# EAGLE schematic Xtriker_Laser_v2 (EAGLE 9.6.1)
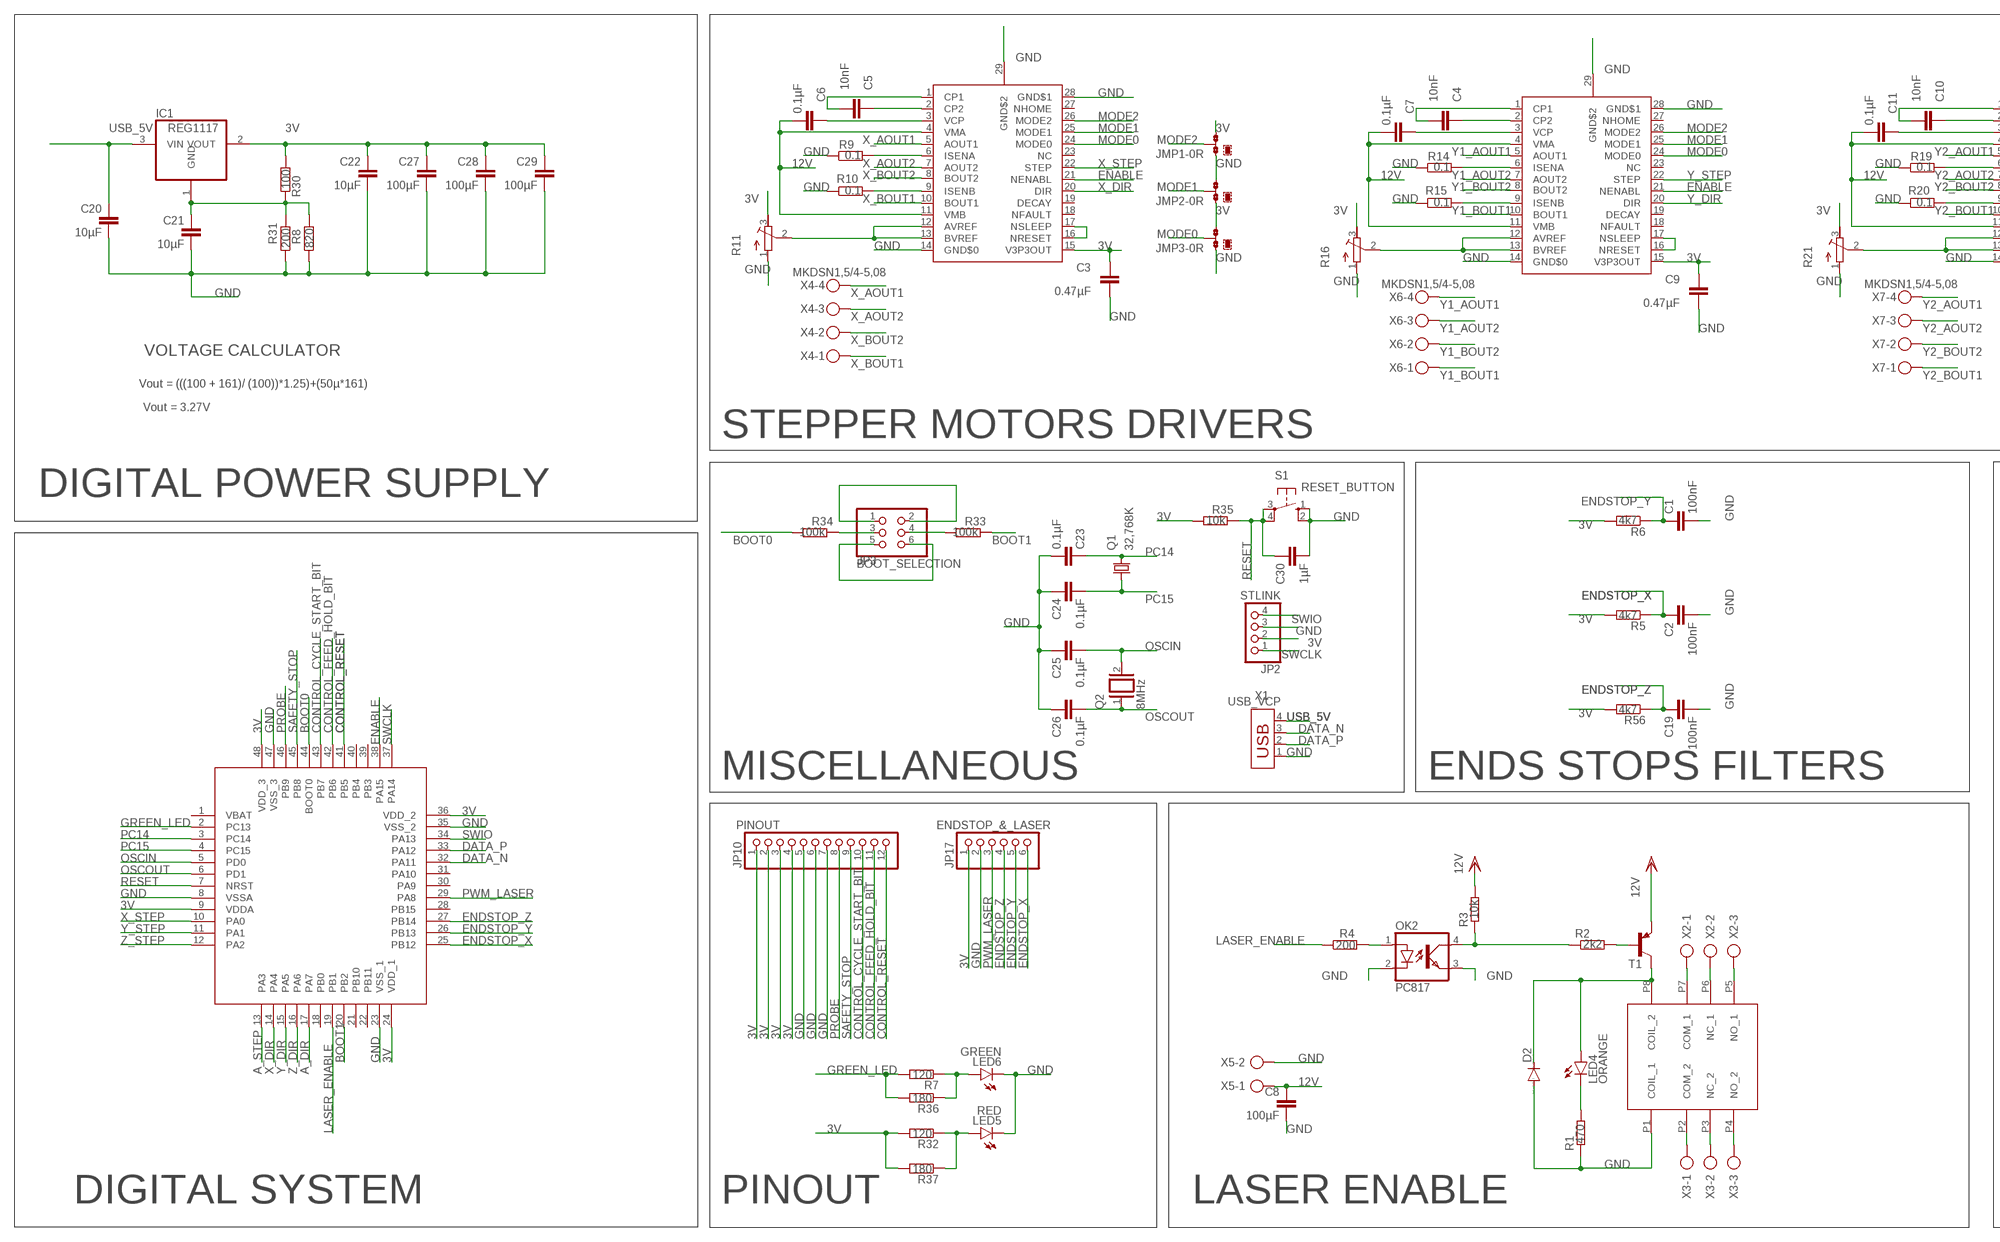
[diagram p0: schematic, sheet 1, part 1 of 2]
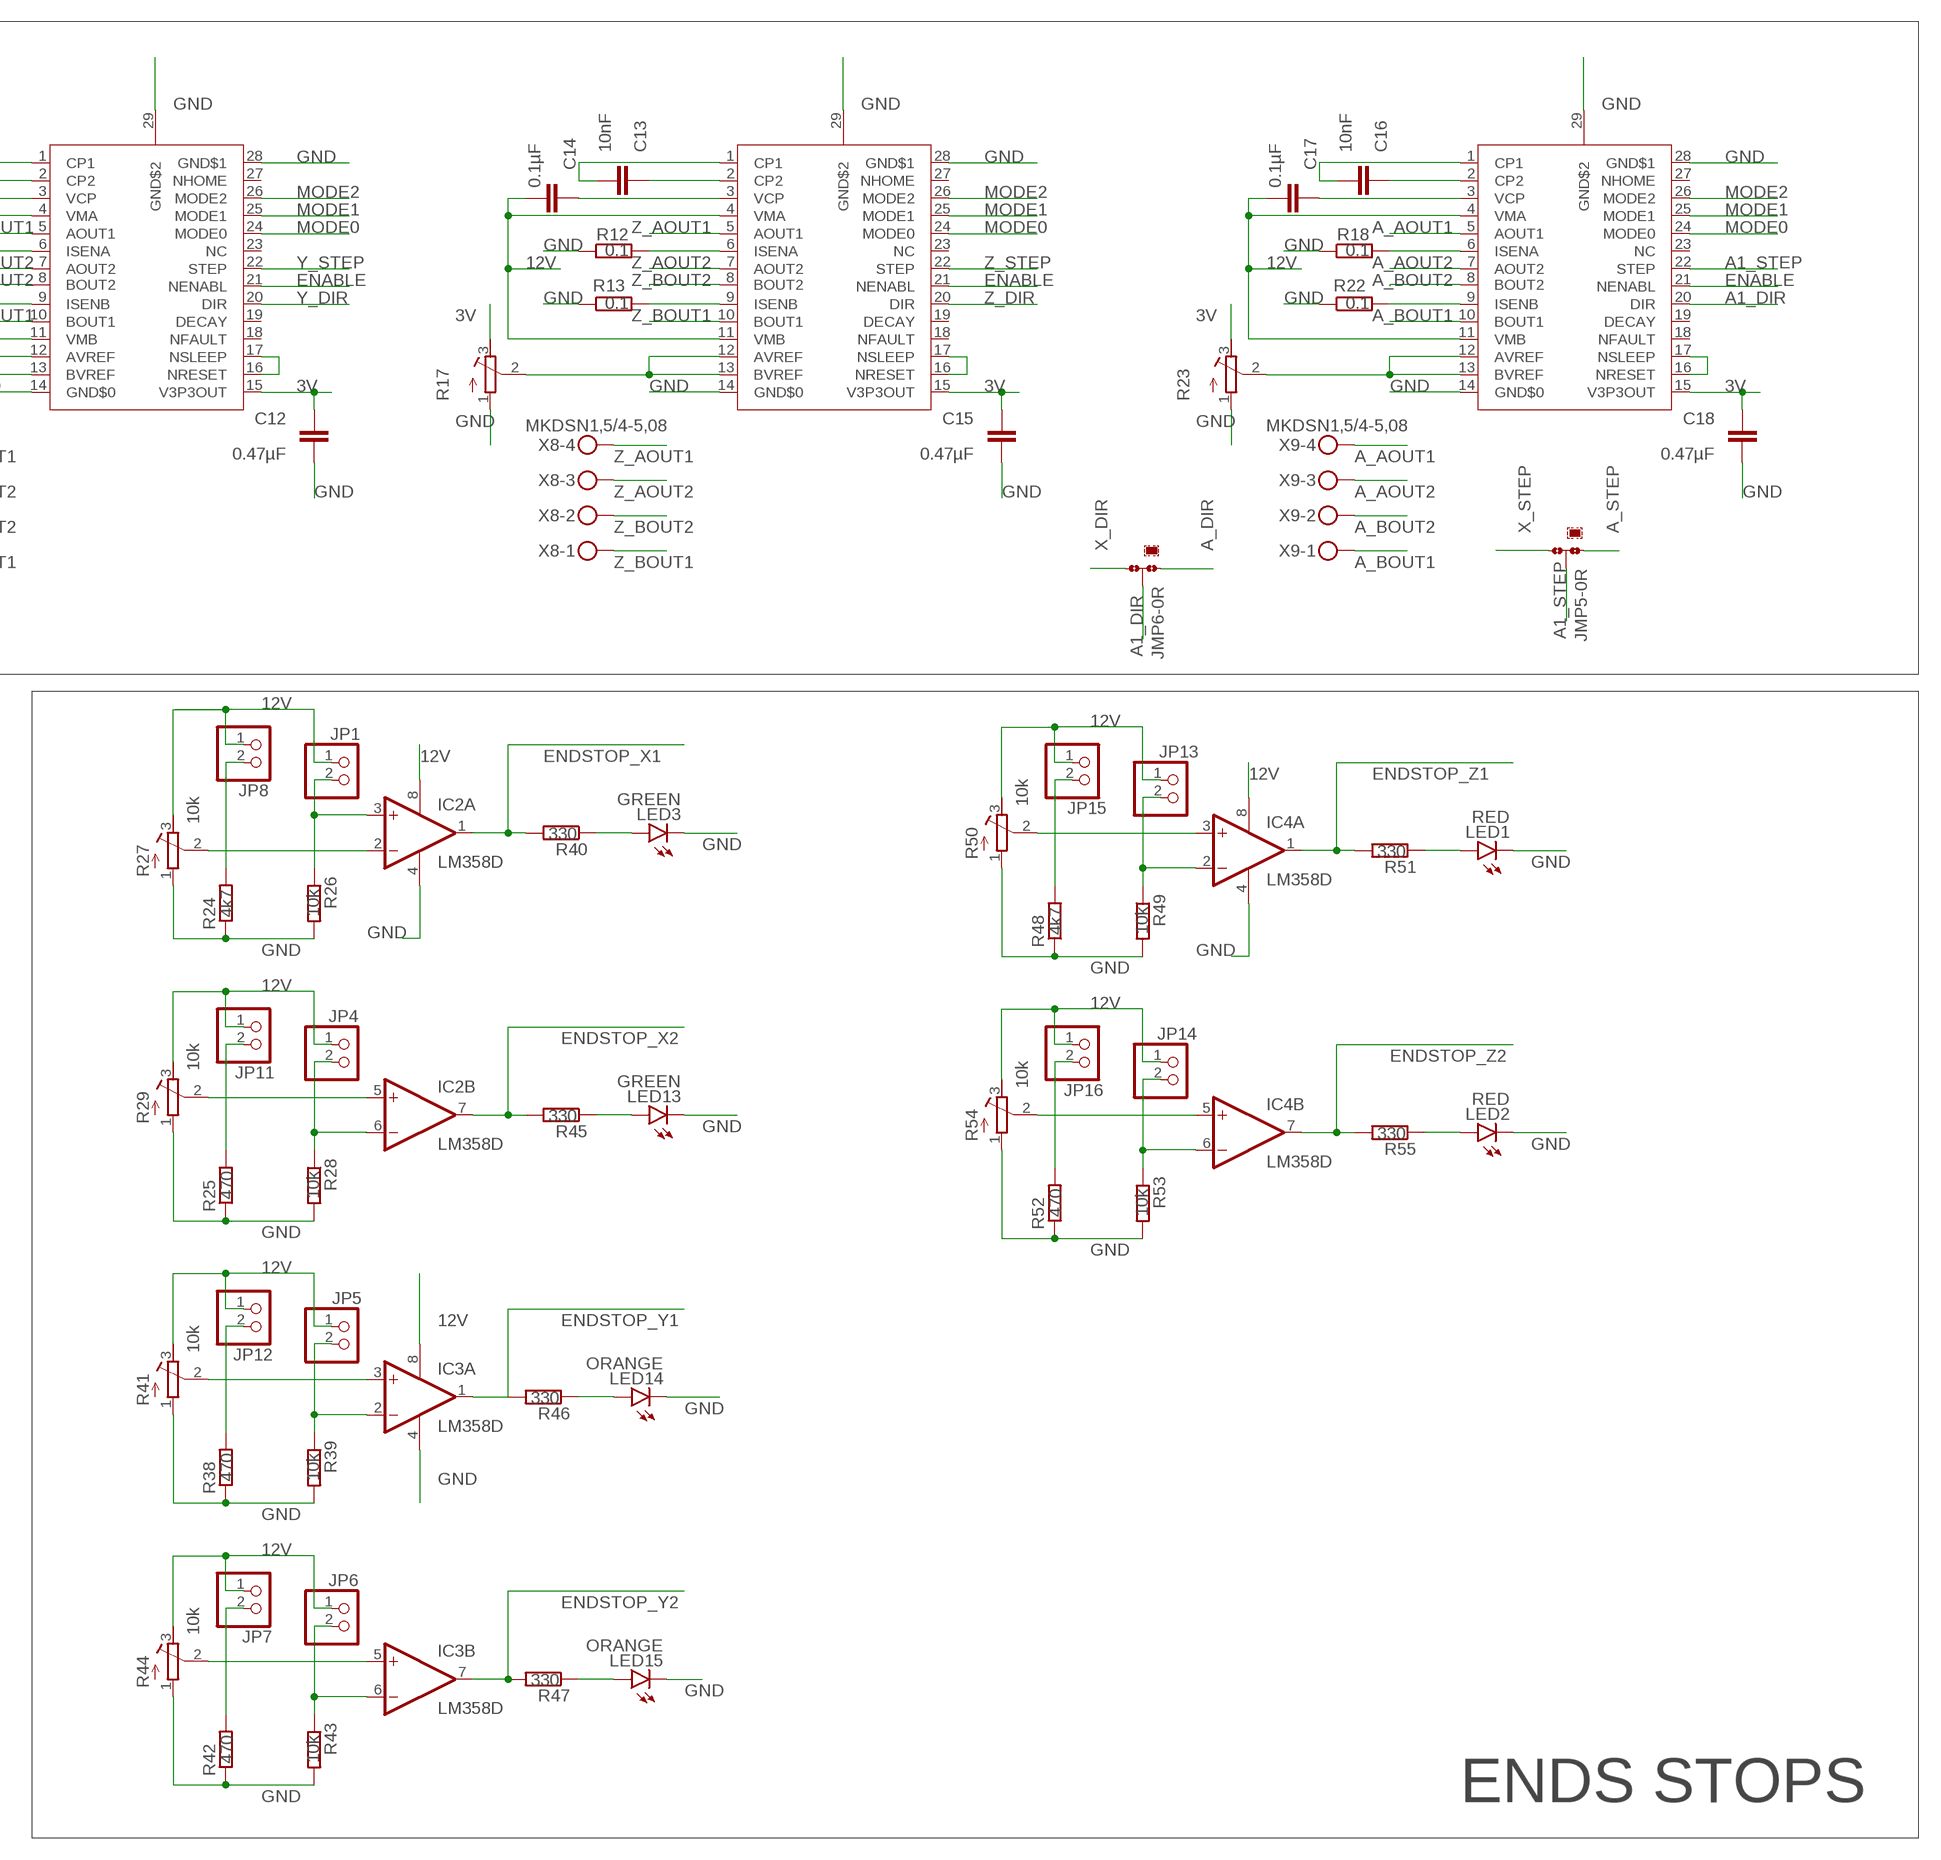
[diagram p1: schematic, sheet 1, part 2 of 2]

## Parts
C1  100nF  C-EUC0805  [C0805]
C2  100nF  C-EUC0805  [C0805]
C3  0.47µF  C-EUC0805  [C0805]
C4  10nF  C-EUC0805  [C0805]
C5  10nF  C-EUC0805  [C0805]
C6  0.1µF  C-EUC0805  [C0805]
C7  0.1µF  C-EUC0805  [C0805]
C8  100µF  C-EUC0805  [C0805]
C9  0.47µF  C-EUC0805  [C0805]
C10  10nF  C-EUC0805  [C0805]
C11  0.1µF  C-EUC0805  [C0805]
C12  0.47µF  C-EUC0805  [C0805]
C13  10nF  C-EUC0805  [C0805]
C14  0.1µF  C-EUC0805  [C0805]
C15  0.47µF  C-EUC0805  [C0805]
C16  10nF  C-EUC0805  [C0805]
C17  0.1µF  C-EUC0805  [C0805]
C18  0.47µF  C-EUC0805  [C0805]
C19  100nF  C-EUC0805  [C0805]
C20  10µF  C-EUC0805  [C0805]
C21  10µF  C-EUC0805  [C0805]
C22  10µF  C-EUC0805  [C0805]
C23  0.1µF  C-EUC0805  [C0805]
C24  0.1µF  C-EUC0805  [C0805]
C25  0.1µF  C-EUC0805  [C0805]
C26  0.1µF  C-EUC0805  [C0805]
C27  100µF  C-EUC0805  [C0805]
C28  100µF  C-EUC0805  [C0805]
C29  100µF  C-EUC0805  [C0805]
C30  1µF  C-EUC0805  [C0805]
D2  DIODE-DO214AA  [DO214AA]
IC1  REG1117  [SOT223]
IC2  LM358D  [SO08]
IC3  LM358D  [SO08]
IC4  LM358D  [SO08]
JMP1  0R-JUMPA  [A0R-JMP]
JMP2  0R-JUMPA  [A0R-JMP]
JMP3  0R-JUMPA  [A0R-JMP]
JMP5  0R-JUMPA  [A0R-JMP]
JMP6  0R-JUMPA  [A0R-JMP]
JP1  PINHD-1X2  [1X02]
JP2  STLINK  PINHD-1X4  [1X04]
JP3  BOOT_SELECTION  PINHD-2X3  [2X03]
JP4  PINHD-1X2  [1X02]
JP5  PINHD-1X2  [1X02]
JP6  PINHD-1X2  [1X02]
JP7  PINHD-1X2  [1X02]
JP8  PINHD-1X2  [1X02]
JP10  PINOUT  PINHD-1X12  [1X12]
JP11  PINHD-1X2  [1X02]
JP12  PINHD-1X2  [1X02]
JP13  PINHD-1X2  [1X02]
JP14  PINHD-1X2  [1X02]
JP15  PINHD-1X2  [1X02]
JP16  PINHD-1X2  [1X02]
JP17  ENDSTOP_&_LASER  PINHD-1X6  [1X06]
LED1  RED  LEDCHIP-LED0805  [CHIP-LED0805]
LED2  RED  LEDCHIP-LED0805  [CHIP-LED0805]
LED3  GREEN  LEDCHIP-LED0805  [CHIP-LED0805]
LED4  ORANGE  LEDCHIP-LED0805  [CHIP-LED0805]
LED5  RED  LEDCHIP-LED0805  [CHIP-LED0805]
LED6  GREEN  LEDCHIP-LED0805  [CHIP-LED0805]
LED13  GREEN  LEDCHIP-LED0805  [CHIP-LED0805]
LED14  ORANGE  LEDCHIP-LED0805  [CHIP-LED0805]
LED15  ORANGE  LEDCHIP-LED0805  [CHIP-LED0805]
OK2  PC817  [DIL04]
Q1  32,768K  KX-327-S  [8.2X3.8]
Q2  8MHz  XTAL/S  [QS]
R1  470  R-EU_R0805  [R0805]
R2  2k2  R-EU_R0805  [R0805]
R3  10k  R-EU_R0805  [R0805]
R4  200  R-EU_R0805  [R0805]
R5  4k7  R-EU_R0805  [R0805]
R6  4k7  R-EU_R0805  [R0805]
R7  120  R-EU_R0805  [R0805]
R8  820  R-EU_R0805  [R0805]
R9  0.1  R-EU_R2512  [R2512]
R10  0.1  R-EU_R2512  [R2512]
R11  R-TRIMM3296W  [RTRIM3296W]
R12  0.1  R-EU_R2512  [R2512]
R13  0.1  R-EU_R2512  [R2512]
R14  0.1  R-EU_R2512  [R2512]
R15  0.1  R-EU_R2512  [R2512]
R16  R-TRIMM3296W  [RTRIM3296W]
R17  R-TRIMM3296W  [RTRIM3296W]
R18  0.1  R-EU_R2512  [R2512]
R19  0.1  R-EU_R2512  [R2512]
R20  0.1  R-EU_R2512  [R2512]
R21  R-TRIMM3296W  [RTRIM3296W]
R22  0.1  R-EU_R2512  [R2512]
R23  R-TRIMM3296W  [RTRIM3296W]
R24  4k7  R-EU_R0805  [R0805]
R25  470  R-EU_R0805  [R0805]
R26  10k  R-EU_R0805  [R0805]
R27  10k  R-TRIMM3296W  [RTRIM3296W]
R28  10k  R-EU_R0805  [R0805]
R29  10k  R-TRIMM3296W  [RTRIM3296W]
R30  100  R-EU_R0805  [R0805]
R31  200  R-EU_R0805  [R0805]
R32  120  R-EU_R0805  [R0805]
R33  100k  R-EU_R0805  [R0805]
R34  100k  R-EU_R0805  [R0805]
R35  10k  R-EU_R0805  [R0805]
R36  180  R-EU_R0805  [R0805]
R37  180  R-EU_R0805  [R0805]
R38  470  R-EU_R0805  [R0805]
R39  10k  R-EU_R0805  [R0805]
R40  330  R-EU_R0805  [R0805]
R41  10k  R-TRIMM3296W  [RTRIM3296W]
R42  470  R-EU_R0805  [R0805]
R43  10k  R-EU_R0805  [R0805]
R44  10k  R-TRIMM3296W  [RTRIM3296W]
R45  330  R-EU_R0805  [R0805]
R46  330  R-EU_R0805  [R0805]
R47  330  R-EU_R0805  [R0805]
R48  4k7  R-EU_R0805  [R0805]
R49  10k  R-EU_R0805  [R0805]
R50  10k  R-TRIMM3296W  [RTRIM3296W]
R51  330  R-EU_R0805  [R0805]
R52  470  R-EU_R0805  [R0805]
R53  10k  R-EU_R0805  [R0805]
R54  10k  R-TRIMM3296W  [RTRIM3296W]
R55  330  R-EU_R0805  [R0805]
R56  4k7  R-EU_R0805  [R0805]
S1  RESET_BUTTON  10-XX  [B3F-10XX]
T1  -PNP-SOT23-BCE  [SOT23-BCE]
U$1  DRV8825  [SOP65P660X135-29T310X518N]
U$2  DRV8825  [SOP65P660X135-29T310X518N]
U$3  DRV8825  [SOP65P660X135-29T310X518N]
U$4  DRV8825  [SOP65P660X135-29T310X518N]
U$5  TDS-1202L  [TDS_1202L]
U$6  STM32F103C8_LQFP48  [QFP50P900X900X160-48N]
U$7  DRV8825  [SOP65P660X135-29T310X518N]
X1  USB_VCP  USB-787616  [USB]
X2  AK500/3  [AK500/3]
X3  AK500/3  [AK500/3]
X4  MKDSN1,5/4-5,08  [MKDSN1,5/4-5,08]
X5  AK500/2  [AK500/2]
X6  MKDSN1,5/4-5,08  [MKDSN1,5/4-5,08]
X7  MKDSN1,5/4-5,08  [MKDSN1,5/4-5,08]
X8  MKDSN1,5/4-5,08  [MKDSN1,5/4-5,08]
X9  MKDSN1,5/4-5,08  [MKDSN1,5/4-5,08]

## Nets
3V: C3.1 C9.1 C12.1 C15.1 C18.1 C22.1 C27.1 C28.1 C29.1 IC1.2(VOUT) JMP1.3 JMP2.1 JMP3.3 JP2.2 JP10.1 JP10.2 JP10.3 JP10.4 JP17.1 R5.2 R6.2 R11.3(E) R16.3(E) R17.3(E) R21.3(E) R23.3(E) R30.2 R32.2 R35.2 R37.2 R56.2 U$1.15(V3P3OUT) U$2.15(V3P3OUT) U$3.15(V3P3OUT) U$4.15(V3P3OUT) U$6.9(VDDA) U$6.24(VDD_1) U$6.36(VDD_2) U$6.48(VDD_3) U$7.15(V3P3OUT)
12V: C6.2 C7.2 C8.1 C11.2 C14.2 C17.2 IC2.8(P:V+) IC3.8(P:V+) IC4.8(P:V+) JP1.1 JP4.1 JP5.1 JP6.1 JP7.1 JP8.1 JP11.1 JP12.1 JP13.1 JP14.1 JP15.1 JP16.1 R27.3(E) R29.3(E) R41.3(E) R44.3(E) R50.3(E) R54.3(E) U$1.4(VMA) U$1.11(VMB) U$2.4(VMA) U$2.11(VMB) U$3.4(VMA) U$3.11(VMB) U$4.4(VMA) U$4.11(VMB) U$7.4(VMA) U$7.11(VMB) X5.1
A1_DIR: JMP6.2 U$7.20(DIR)
A1_STEP: JMP5.2 U$7.22(STEP)
A_AOUT1: U$7.5(AOUT1) X9.4
A_AOUT2: U$7.7(AOUT2) X9.3
A_BOUT1: U$7.10(BOUT1) X9.1
A_BOUT2: U$7.8(BOUT2) X9.2
A_DIR: JMP6.1 U$6.17(PA7)
A_STEP: JMP5.1 U$6.13(PA3)
BOOT0: R34.2 U$6.44(BOOT0)
BOOT1: R33.1 U$6.20(PB2)
CONTROL_CYCLE_START_BIT: JP10.10 U$6.43(PB7)
CONTROL_FEED_HOLD_BIT: JP10.11 U$6.42(PB6)
CONTROL_RESET: JP10.12 U$6.41(PB5)
DATA_N [Diff]: U$6.32(PA11) X1.3
DATA_P [Diff]: U$6.33(PA12) X1.2
ENABLE: U$1.21(NENABL) U$2.21(NENABL) U$3.21(NENABL) U$4.21(NENABL) U$6.38(PA15) U$7.21(NENABL)
ENDSTOP_X: C2.1 JP17.6 R5.1 U$6.25(PB12)
ENDSTOP_X1: IC2.1(A:OUT) R40.2
ENDSTOP_X2: IC2.7(B:OUT) R45.2
ENDSTOP_Y: C1.1 JP17.5 R6.1 U$6.26(PB13)
ENDSTOP_Y1: IC3.1(A:OUT) R46.2
ENDSTOP_Y2: IC3.7(B:OUT) R47.2
ENDSTOP_Z: C19.1 JP17.4 R56.1 U$6.27(PB14)
ENDSTOP_Z1: IC4.1(A:OUT) R51.2
ENDSTOP_Z2: IC4.7(B:OUT) R55.2
GND: C1.2 C2.2 C3.2 C8.2 C9.2 C12.2 C15.2 C18.2 C19.2 C20.2 C21.2 C22.2 C23.2 C24.1 C25.1 C26.1 C27.2 C28.2 C29.2 C30.2 D2.A IC2.4(P:V-) IC3.4(P:V-) IC4.4(P:V-) JMP1.1 JMP2.3 JMP3.1 JP2.3 JP10.5 JP10.6 JP10.7 JP17.2 LED1.C LED2.C LED3.C LED5.C LED6.C LED13.C LED14.C LED15.C OK2.2(C) OK2.3(EMIT) R1.1 R8.1 R9.1 R10.1 R11.1(A) R12.1 R13.1 R14.1 R15.1 R16.1(A) R17.1(A) R18.1 R19.1 R20.1 R21.1(A) R22.1 R23.1(A) R24.1 R25.1 R26.2 R27.1(A) R28.2 R29.1(A) R31.1 R38.1 R39.2 R41.1(A) R42.1 R43.2 R44.1(A) R48.1 R49.2 R50.1(A) R52.1 R53.2 R54.1(A) S1.1(S) S1.2(S1) U$1.14(GND$0) U$1.28(GND$1) U$1.29(GND$2) U$2.14(GND$0) U$2.28(GND$1) U$2.29(GND$2) U$3.14(GND$0) U$3.28(GND$1) U$3.29(GND$2) U$4.14(GND$0) U$4.28(GND$1) U$4.29(GND$2) U$5.P1(COIL_1) U$6.8(VSSA) U$6.23(VSS_1) U$6.35(VSS_2) U$6.47(VSS_3) U$7.14(GND$0) U$7.28(GND$1) U$7.29(GND$2) X1.1 X5.2
GREEN_LED: R7.2 R36.2 U$6.2(PC13)
LASER_ENABLE: R4.1 U$6.19(PB1)
MODE0: JMP3.2 U$1.24(MODE0) U$2.24(MODE0) U$3.24(MODE0) U$4.24(MODE0) U$7.24(MODE0)
MODE1: JMP2.2 U$1.25(MODE1) U$2.25(MODE1) U$3.25(MODE1) U$4.25(MODE1) U$7.25(MODE1)
MODE2: JMP1.2 U$1.26(MODE2) U$2.26(MODE2) U$3.26(MODE2) U$4.26(MODE2) U$7.26(MODE2)
N$1: C13.2 U$4.1(CP1)
N$2: U$1.16(NRESET) U$1.17(NSLEEP)
N$3: C4.2 U$2.1(CP1)
N$4: C4.1 U$2.2(CP2)
N$5: C7.1 U$2.3(VCP)
N$6: R14.2 U$2.6(ISENA)
N$7: R15.2 U$2.9(ISENB)
N$8: R16.2(S) U$2.12(AVREF) U$2.13(BVREF)
N$9: C21.1 IC1.1(GND) R8.2 R30.1 R31.2
N$10: LED5.A R32.1 R37.1
N$11: JP3.1 JP3.2
N$12: C13.1 U$4.2(CP2)
N$13: D2.C LED4.A T1.C U$5.P8(COIL_2)
N$14: LED4.C R1.2
N$15: R2.2 T1.B
N$16: OK2.4(COL) R2.1 R3.1
N$17: OK2.1(A) R4.2
N$18: U$2.16(NRESET) U$2.17(NSLEEP)
N$19: C10.2 U$3.1(CP1)
N$20: C10.1 U$3.2(CP2)
N$21: C11.1 U$3.3(VCP)
N$22: C5.2 U$1.1(CP1)
N$23: C5.1 U$1.2(CP2)
N$24: C6.1 U$1.3(VCP)
N$25: R19.2 U$3.6(ISENA)
N$26: R20.2 U$3.9(ISENB)
N$27: R9.2 U$1.6(ISENA)
N$28: R21.2(S) U$3.12(AVREF) U$3.13(BVREF)
N$29: U$5.P7(COM_1) X2.1
N$30: U$5.P6(NC_1) X2.2
N$31: U$5.P5(NO_1) X2.3
N$32: U$5.P4(NO_2) X3.3
N$33: U$5.P3(NC_2) X3.2
N$34: U$5.P2(COM_2) X3.1
N$35: LED6.A R7.1 R36.1
N$36: C14.1 U$4.3(VCP)
N$37: R10.2 U$1.9(ISENB)
N$38: U$3.16(NRESET) U$3.17(NSLEEP)
N$39: LED3.A R40.1
N$40: IC2.3(A:+IN) JP1.2 R26.1
N$41: JP3.5 JP3.6
N$42: JP3.3 R34.1
N$43: JP3.4 R33.2
N$44: R11.2(S) U$1.12(AVREF) U$1.13(BVREF)
N$45: JP8.2 R24.2
N$46: IC2.6(B:-IN) JP4.2 R28.1
N$47: IC2.2(A:-IN) R27.2(S)
N$48: JP11.2 R25.2
N$49: IC2.5(B:+IN) R29.2(S)
N$50: IC3.2(A:-IN) JP5.2 R39.1
N$51: JP12.2 R38.2
N$52: IC3.3(A:+IN) R41.2(S)
N$53: IC3.6(B:-IN) JP6.2 R43.1
N$54: JP7.2 R42.2
N$55: IC3.5(B:+IN) R44.2(S)
N$56: LED13.A R45.1
N$57: LED14.A R46.1
N$58: LED15.A R47.1
N$59: R12.2 U$4.6(ISENA)
N$60: R13.2 U$4.9(ISENB)
N$61: R17.2(S) U$4.12(AVREF) U$4.13(BVREF)
N$62: U$4.16(NRESET) U$4.17(NSLEEP)
N$63: C16.2 U$7.1(CP1)
N$64: C16.1 U$7.2(CP2)
N$65: C17.1 U$7.3(VCP)
N$66: R18.2 U$7.6(ISENA)
N$67: R22.2 U$7.9(ISENB)
N$68: R23.2(S) U$7.12(AVREF) U$7.13(BVREF)
N$69: U$7.16(NRESET) U$7.17(NSLEEP)
N$70: IC4.2(A:-IN) JP13.2 R49.1
N$71: JP15.2 R48.2
N$72: IC4.3(A:+IN) R50.2(S)
N$73: LED1.A R51.1
N$74: IC4.6(B:-IN) JP14.2 R53.1
N$75: JP16.2 R52.2
N$76: IC4.5(B:+IN) R54.2(S)
N$77: LED2.A R55.1
OSCIN: C25.2 Q2.2 U$6.5(PD0)
OSCOUT: C26.2 Q2.1 U$6.6(PD1)
PC14: C23.1 Q1.4 U$6.3(PC14)
PC15: C24.2 Q1.1 U$6.4(PC15)
PROBE: JP10.8 U$6.46(PB9)
PWM_LASER: JP17.3 U$6.29(PA8)
RESET: C30.1 R35.1 S1.3(P) S1.4(P1) U$6.7(NRST)
SAFETY_STOP: JP10.9 U$6.45(PB8)
SWCLK: JP2.1 U$6.37(PA14)
SWIO: JP2.4 U$6.34(PA13)
USB_5V: C20.1 IC1.3(VIN) X1.4
VDD: R3.2 T1.E ; supply symbol labelled 12V
X_AOUT1: U$1.5(AOUT1) X4.4
X_AOUT2: U$1.7(AOUT2) X4.3
X_BOUT1: U$1.10(BOUT1) X4.1
X_BOUT2: U$1.8(BOUT2) X4.2
X_DIR: JMP6.3 U$1.20(DIR) U$6.14(PA4)
X_STEP: JMP5.3 U$1.22(STEP) U$6.10(PA0)
Y1_AOUT1: U$2.5(AOUT1) X6.4
Y1_AOUT2: U$2.7(AOUT2) X6.3
Y1_BOUT1: U$2.10(BOUT1) X6.1
Y1_BOUT2: U$2.8(BOUT2) X6.2
Y2_AOUT1: U$3.5(AOUT1) X7.4
Y2_AOUT2: U$3.7(AOUT2) X7.3
Y2_BOUT1: U$3.10(BOUT1) X7.1
Y2_BOUT2: U$3.8(BOUT2) X7.2
Y_DIR: U$2.20(DIR) U$3.20(DIR) U$6.15(PA5)
Y_STEP: U$2.22(STEP) U$3.22(STEP) U$6.11(PA1)
Z_AOUT1: U$4.5(AOUT1) X8.4
Z_AOUT2: U$4.7(AOUT2) X8.3
Z_BOUT1: U$4.10(BOUT1) X8.1
Z_BOUT2: U$4.8(BOUT2) X8.2
Z_DIR: U$4.20(DIR) U$6.16(PA6)
Z_STEP: U$4.22(STEP) U$6.12(PA2)
Unconnected: U$1.18(NFAULT) U$1.19(DECAY) U$1.23(NC) U$1.27(NHOME) U$2.18(NFAULT) U$2.19(DECAY) U$2.23(NC) U$2.27(NHOME) U$3.18(NFAULT) U$3.19(DECAY) U$3.23(NC) U$3.27(NHOME) U$4.18(NFAULT) U$4.19(DECAY) U$4.23(NC) U$4.27(NHOME) U$6.1(VBAT) U$6.18(PB0) U$6.21(PB10) U$6.22(PB11) U$6.28(PB15) U$6.30(PA9) U$6.31(PA10) U$6.39(PB3) U$6.40(PB4) U$7.18(NFAULT) U$7.19(DECAY) U$7.23(NC) U$7.27(NHOME)

## Notes on the sheet
- VOLTAGE CALCULATOR
- Vout = (((100 + 161)/ (100))*1.25)+(50µ*161)
- Vout = 3.27V
- STEPPER MOTORS DRIVERS
- DIGITAL POWER SUPPLY
- MISCELLANEOUS | ENDS STOPS FILTERS
- DIGITAL SYSTEM | PINOUT | LASER ENABLE | ENDS STOPS

## Library data of the parts
C1-C30 = rcl:C-EU: CAPACITOR, European symbol; SPICEPREFIX: C
D2 = diode:DIODE-: DIODE
IC1 = burr-brown:REG1117: 800mA and 1A Low Dropout (LDO) Positive Regulator 1.8V, 2.5V, 2.85V, 3.3V, 5V, and Adj; MPN: REG1117; OC_FARNELL: 1097566; OC_NEWARK: 14P6981
IC2-IC4 = linear:LM358: OP AMP also LM158; LM258; LM2904 Source: http://cache.national.com/ds/LM/LM158.pdf
JMP1-JMP3 JMP5 JMP6 = jump-0r-smd:0R-JUMP: SMD 0R 0805 Jumper
JP1 JP4-JP8 JP11-JP16 = pinhead:PINHD-1X2: PIN HEADER
JP2 = pinhead:PINHD-1X4: PIN HEADER
JP3 = pinhead:PINHD-2X3: PIN HEADER
JP10 = pinhead:PINHD-1X12: PIN HEADER
JP17 = pinhead:PINHD-1X6: PIN HEADER
LED1-LED6 LED13-LED15 = led:LED: LED OSRAM: - CHIPLED LG R971, LG N971, LY N971, LG Q971, LY Q971, LO R971, LY R971 LH N974, LH R974 LS Q976, LO Q976, LY Q976 LO Q996 - Hyper CHIPLED LW Q18S LB Q993, LB Q99A, LB R99A - SideLED LS A670, LO A670, LY A670, LG A670, LP A670 LB A673, LV A673, LT A673, LW A673 LH A674 LY A675 LS A676, LA A676, LO A676, LY A676, LW A676 LS A679, LY A679, LG A679 - Hyper Micro SIDELED® LS Y876, LA Y876, LO Y876, LY Y876 LT Y87S - SmartLED LW L88C, LW L88S LB L89C, LB L89S, LG L890 LS L89K, LO L89K, LY L89K LS L896, LA L896, LO L896, LY L896 - TOPLED LS T670, LO T670, LY T670, LG T670, LP T670 LSG T670, LSP T670, LSY T670, LOP T670, LYG T670 LG T671, LOG T671, LSG T671 LB T673, LV T673, LT T673, LW T673 LH T674 LS T676, LA T676, LO T676, LY T676, LB T676, LH T676, LSB T676, LW T676 LB T67C, LV T67C, LT T67C, LS T67K, LO T67K, LY T67K, LW E67C LS E67B, LA E67B, LO E67B, LY E67B, LB E67C, LV E67C, LT E67C LW T67C LS T679, LY T679, LG T679 LS T770, LO T770, LY T770, LG T770, LP T770 LB T773, LV T773, LT T773, LW T773 LH T774 LS E675, LA E675, LY E675, LS T675 LS T776, LA T776, LO T776, LY T776, LB T776 LHGB T686 LT T68C, LB T68C - Hyper Mini TOPLED® LB M676 - Mini TOPLED Santana® LG M470 LS M47K, LO M47K, LY M47K Source: http://www.osram.convergy.de LUXEON: - LUMILED® LXK2-PW12-R00, LXK2-PW12-S00, LXK2-PW14-U00, LXK2-PW14-V00 LXK2-PM12-R00, LXK2-PM12-S00, LXK2-PM14-U00 LXK2-PE12-Q00, LXK2-PE12-R00, LXK2-PE12-S00, LXK2-PE14-T00, LXK2-PE14-U00 LXK2-PB12-K00, LXK2-PB12-L00, LXK2-PB12-M00, LXK2-PB14-N00, LXK2-PB14-P00, LXK2-PB14-Q00 LXK2-PR12-L00, LXK2-PR12-M00, LXK2-PR14-Q00, LXK2-PR14-R00 LXK2-PD12-Q00, LXK2-PD12-R00, LXK2-PD12-S00 LXK2-PH12-R00, LXK2-PH12-S00 LXK2-PL12-P00, LXK2-PL12-Q00, LXK2-PL12-R00 Source: www.luxeon.com KINGBRIGHT: KA-3528ASYC Source: www.kingbright.com
OK2 = optocoupler:PC817: SHARP OPTO COUPLER; MPN: PC817X4J000F; OC_FARNELL: 9707727; OC_NEWARK: 97K7059
Q1 = crystal-geyer_V1_0:KX-327: Tuning Fork Crystals (kHz) SMD: KX327 - Serie Model Size l/w/h [mm] Frequency Range Frequency Stability Temp. Range [°C] Load Capacitance AECQ 200 availabel Datasheet KX-327VT KX-327FT KX-327RT KX-327NHT KX-327NHF KX-327L KX-327S 1.25/1.05/0.5 1.6/1.0/0.5 2.0/1.2/0.6 3.2/1.5/0.8 3.2/1.5/0.8 7.0/1.5/1.4 8.2/3.8/2.5 32,768 kHz 32,768 kHz 32,768 kHz 32,768 kHz 32,768 kHz 32,768 kHz 32,768 kHz ±10 … ±20ppm ±10 … ±20ppm ±10 … ±20ppm ±10 … ±20ppm ±10 … ±20ppm ±10 … ±20ppm ±5 … ±20ppm (*) -40°C …+85°C (*) -40°C …+85°C (*) -40°C …+85°C (*) -40°C …+85°C (*) -40°C …+125°C (*) -40°C …+85°C (*) -40°C …+85°C 7/9/12,5 7/9/12,5 7/9/12,6 7/9/12,5 9/12,5 7/9/12,5 6/12,5 - - - - yes - - KX-327VT.pdf <http://www.geyer-electronic.de/uploads/tx_userartikelfrequenz/GEYER-KX-327VT.pdf> KX-327FT.pdf <http://www.geyer-electronic.de/uploads/tx_userartikelfrequenz/GEYER-KX-327FT.pdf> KX-327RT.pdf <http://www.geyer-electronic.de/uploads/tx_userartikelfrequenz/GEYER-KX-327RT.pdf> KX-327NHT.pdf <http://www.geyer-electronic.de/uploads/tx_userartikelfrequenz/GEYER-KX-327NHT.pdf> KX-327NHF.pdf <http://www.geyer-electronic.de/uploads/tx_userartikelfrequenz/GEYER-KX-327NHF.pdf> KX-327L.pdf <http://www.geyer-electronic.de/uploads/tx_userartikelfrequenz/GEYER-KX-327L.pdf> KX-327S.pdf <http://www.geyer-electronic.de/uploads/tx_userartikelfrequenz/GEYER-KX-327S.pdf> <http://www.geyer-electronic.de/fileadmin/template/img/logo-geyer-electronic.png> Details see: http://www.geyer-electronic.de/Frequenz-Produkte.9.0.html Created 2016-06-07, Hans Locher 2016 (C) Geyer Quartz Technology KX327VT,KX327FT,KX327RT,KX327NHT,KX327NHF,KX327S,KX327L;125105;1610;2012;3215;7015;8238;1,25x1,05,1.25x1.05;1,6x1,0,1.6x1.0;2,0x1,2,2.0x1.2;3,2x1,5,3.2x1.5;8,2x3,8,8.2x3.8,7.0x1.5,7,0x1,532.768kHz
Q2 = special:XTAL/S: CRYSTAL
R1-R10 R12-R15 R18-R20 R22 R24-R26 R28 R30-R40 R42 R43 R45-R49 R51-R53 R55 R56 = rcl:R-EU_: RESISTOR, European symbol; SPICEPREFIX: R
R11 R16 R17 R21 R23 R27 R29 R41 R44 R50 R54 = rcl:R-TRIMM: Trimm resistor; SPICEMODEL: X; SPICEPREFIXL: POT
S1 = switch-omron:10-XX: OMRON SWITCH; MPN: B3F-1000; OC_FARNELL: 176432; OC_NEWARK: 36M3542
T1 = transistor:*-PNP-: PNP Transistror
U$1-U$4 U$7 = DRV8825:DRV8825
U$5 = TDS-1202L:TDS-1202L
U$6 = STM32F103C8:STM32F103C8_LQFP48
X1 = con-amp:USB-787616: AMP connector
X2 X3 = con-ptr500:AK500/3: CONNECTOR; OC_FARNELL: unknown; OC_NEWARK: unknown
X4 X6-X9 = con-phoenix-508:MKDSN1,5/4-5,08: MKDSN 1,5/ 4-5,08 Printklemme Nennstrom: 13,5 A Nennspannung: 250 V Rastermaß: 5,08 mm Polzahl: 4 Anschlussart: Schraubanschluss Montage: Löten Anschlussrichtung Leiter/Platine: 0 ° Artikelnummer: 1729144 Source: http://eshop.phoenixcontact.com .. 1729144.pdf
X5 = con-ptr500:AK500/2: CONNECTOR; OC_FARNELL: unknown; OC_NEWARK: unknown

## Net classes
1 Diff: width 0.152 mm